# EasyEDA Pro project ProPrj_FOC Motor Driver _V02.epro, schematic Schematic1
Board Name: Board1; Create Date: 2026-07-21; Page Name: P1; Project Name: FOC Motor Driver; Schematic Name: Schematic1; Update Date: 2026-07-21; Company: EasyEDA.com; Page Size: A4; Version: V1.0
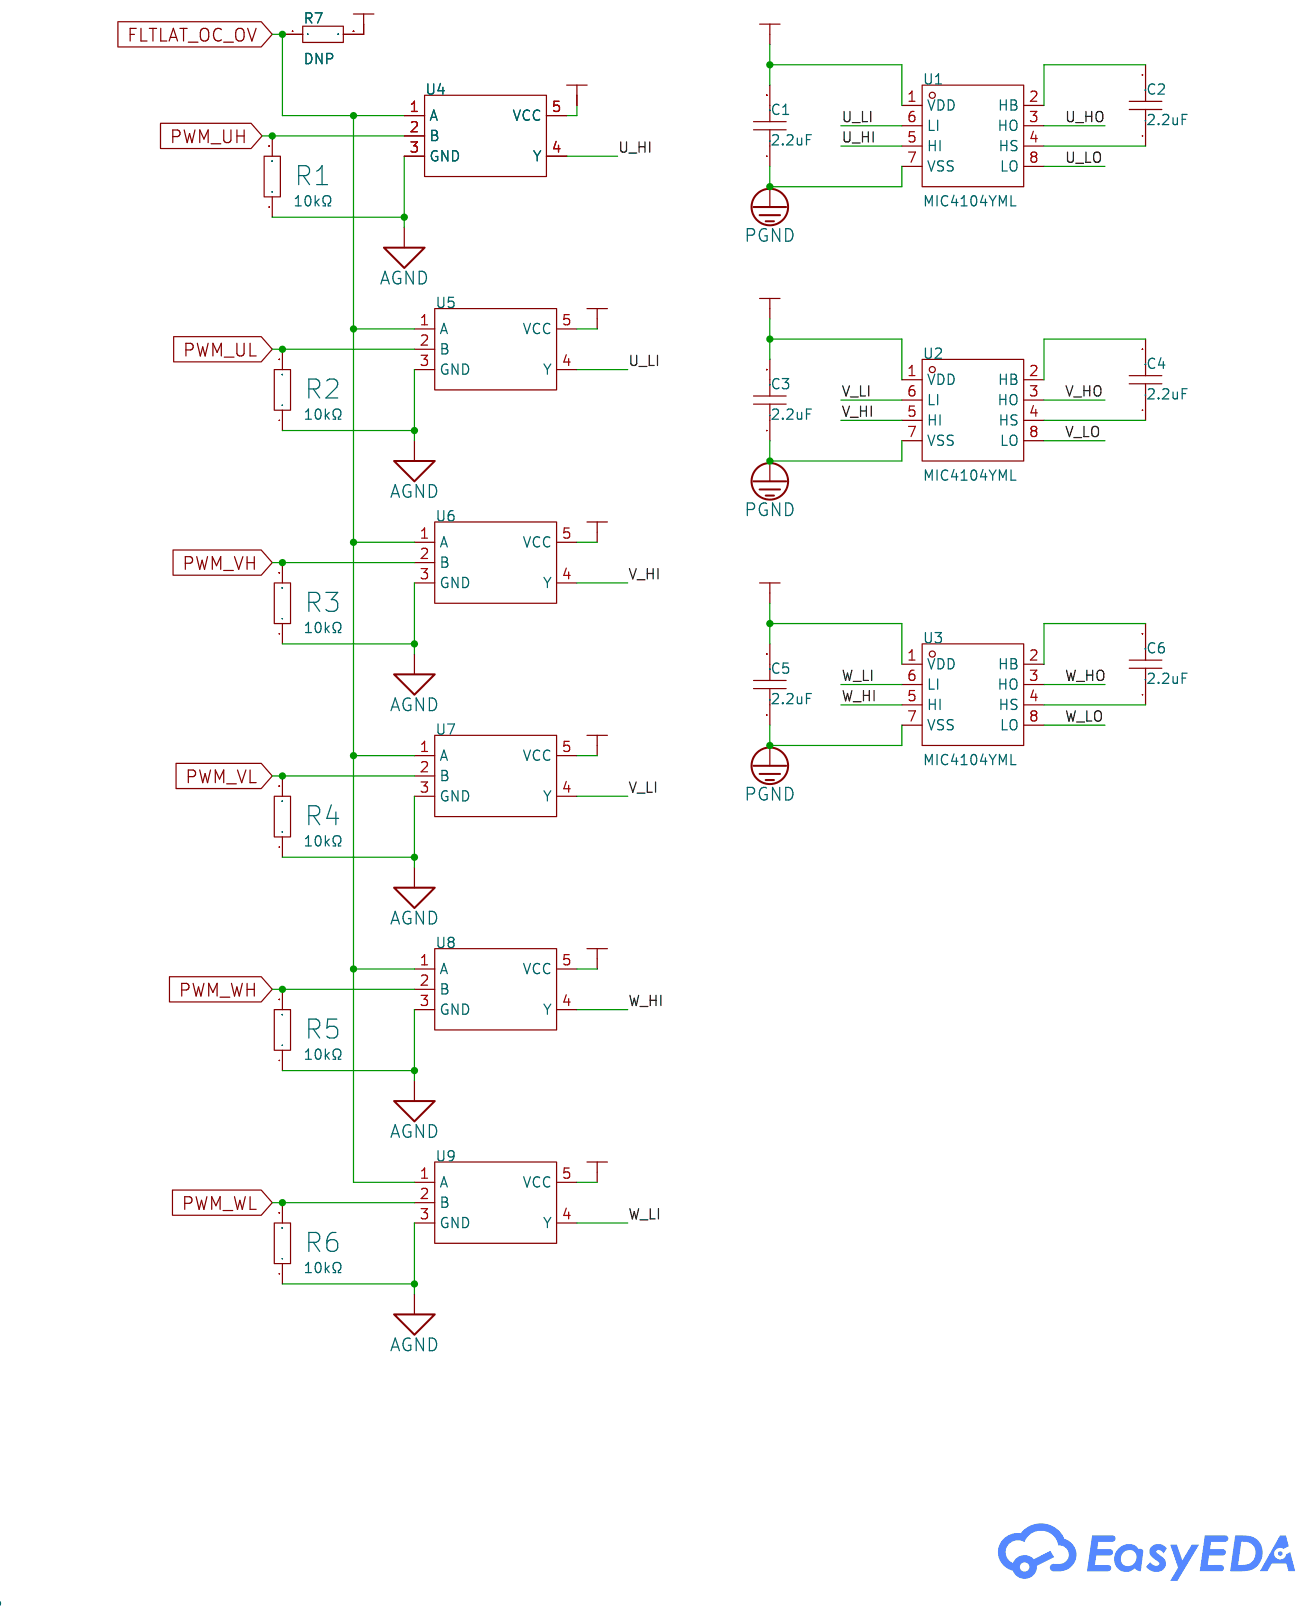
[diagram p0: schematic sheet]

## Parts
C1  2.2uF  [C0805]
C2  2.2uF  [C0805]
C3  2.2uF  [C0805]
C4  2.2uF  [C0805]
C5  2.2uF  [C0805]
C6  2.2uF  [C0805]
R1  10kΩ  [R0603]
R2  10kΩ  [R0603]
R3  10kΩ  [R0603]
R4  10kΩ  [R0603]
R5  10kΩ  [R0603]
R6  10kΩ  [R0603]
R7  0Ω  [R0603]
U1  MIC4104YML  [SOIC-8_L4.9-W3.9-P1.27-LS6.0-BL]
U2  MIC4104YML  [SOIC-8_L4.9-W3.9-P1.27-LS6.0-BL]
U3  MIC4104YML  [SOIC-8_L4.9-W3.9-P1.27-LS6.0-BL]
U4  SN74LVC1G08DCKR(UMW)  [SC-70-5_L2.0-W1.3-P0.65-LS2.1-BR]
U5  SN74LVC1G08DCKR(UMW)  [SC-70-5_L2.0-W1.3-P0.65-LS2.1-BR]
U6  SN74LVC1G08DCKR(UMW)  [SC-70-5_L2.0-W1.3-P0.65-LS2.1-BR]
U7  SN74LVC1G08DCKR(UMW)  [SC-70-5_L2.0-W1.3-P0.65-LS2.1-BR]
U8  SN74LVC1G08DCKR(UMW)  [SC-70-5_L2.0-W1.3-P0.65-LS2.1-BR]
U9  SN74LVC1G08DCKR(UMW)  [SC-70-5_L2.0-W1.3-P0.65-LS2.1-BR]

## Library data of the parts
C1-C6 = CL21A225KBQNNNE: Capacitance:2.2uF Tolerance:±10% Tolerance:±10% Voltage Rating:50V Temperature Coefficient:X5R; LCSC Part Name: 2.2uF ±10% 50V; Supplier Part: C377773; Manufacturer: SAMSUNG(三星); Supplier Footprint: 0805; Datasheet: https://item.szlcsc.com/datasheet/CL21A225KBQNNNE/350246.html; Supplier: LCSC; Tolerance: ±10%; Voltage Rating: 50V; Temperature Coefficient: X5R
R1-R6 = 0603WAF1002T5E: Type:Thick Film Resistor Resistance:10kΩ Tolerance:±1% Tolerance:±1% Power(Watts):100mW Voltage-Supply(Max):75V Temperature Coefficient:±100ppm/℃ Temperature Coefficient:±100ppm/℃ Operating Temperature:-55℃~+155℃ Operating Temperature:-55℃~+155℃; LCSC Part Name: 厚膜电阻 10kΩ ±1% 100mW; Supplier Part: C25804; Manufacturer: UNI-ROYAL(厚声); Supplier Footprint: 0603; JLCPCB Part Class: Basic Part; Datasheet: https://item.szlcsc.com/datasheet/0603WAF1002T5E/26547.html; Supplier: LCSC; Type: Thick Film Resistor; Tolerance: ±1%; Power(Watts): 100mW; Voltage-Supply(Max): 75V; Temperature Coefficient: ±100ppm/℃; Operating Temperature: -55℃~+155℃
R7 = 0603WAF0000T5E: Type:Thick Film Resistor Resistance:0Ω Tolerance:±1% Tolerance:±1% Power(Watts):100mW Voltage-Supply(Max):75V Temperature Coefficient:- Temperature Coefficient:- Operating Temperature:-55℃~+155℃ Operating Temperature:-55℃~+155℃; LCSC Part Name: 0Ω ±1% 100mW 厚膜电阻; Supplier Part: C21189; Manufacturer: UNI-ROYAL(厚声); Supplier Footprint: 0603; Datasheet: https://item.szlcsc.com/datasheet/0603WAF0000T5E/21903.html; Supplier: LCSC; Type: Thick Film Resistor; Tolerance: ±1%; Power(Watts): 100mW; Voltage-Supply(Max): 75V; Operating Temperature: -55℃~+155℃
U1-U3 = MIC4104YML: Driven Configuration:Half-Bridge Load Type:MOSFET Number of Drivers:2 Current - Output Low(IOL):3A Current - Output High(IOH):2A Voltage - Supply:9V~16V Voltage - Supply:9V~16V Rise Time:10ns Fall Time:6ns Propagation Delay tpLH:- Propagation Delay tpHL:-; Supplier Part: C3655660; Manufacturer: MICROCHIP(美国微芯); Supplier Footprint: SOIC-8; Datasheet: https://item.szlcsc.com/datasheet/MIC4104YML/4223457.html; Supplier: LCSC; Driven Configuration: Half-Bridge; Load Type: MOSFET; Number of Drivers: 2; Current - Output Low(IOL): 3A; Current - Output High(IOH): 2A; Voltage - Supply: 9V~16V; Rise Time: 10ns; Fall Time: 6ns; Features: Under Voltage Protection; Operating Temperature: -40℃~+125℃
U4-U9 = SN74LVC1G08DCKR(UMW): Logic Type:AND Gate Number of Channels:1 Voltage - Supply:1.65V~5.5V Voltage - Supply:1.65V~5.5V Quiescent Current:10uA Current - Output Low(IOL):32mA Current - Output High(IOH):32mA Input Logic Level - High:1.7V Input Logic Level - High:1.7V Input Logic; LCSC Part Name: 逻辑芯片; Supplier Part: C2983745; Manufacturer: UMW(友台半导体); Supplier Footprint: SC-70-5; JLCPCB Part Class: Extended Part; Datasheet: https://item.szlcsc.com/datasheet/SN74LVC1G08DCKR(UMW)/3422605.html; Supplier: LCSC; Logic Type: AND Gate; Number of Channels: 1; Voltage - Supply: 1.65V~5.5V; Quiescent Current: 10uA; Current - Output Low(IOL): 32mA; Current - Output High(IOH): 32mA; Input Logic Level - High: 1.7V; Input Logic Level - Low: 700mV; Output Logic Level - High: 1.9V；2.4V；2.3V；1.2V；3.8V; Output Logic Level - Low: 550mV；550mV；100mV；300mV；400mV；450mV; Series: 74LVC Series; Propagation Delay: 10ns@5V,15pF; Operating Temperature: -40℃~+105℃; Input Number: 2

## Nets
3.3V: R7.2 U4.5(VCC) U5.5(VCC) U6.5(VCC) U7.5(VCC) U8.5(VCC) U9.5(VCC)
12V: C1.2 C3.2 C5.2 U1.1(VDD) U2.1(VDD) U3.1(VDD)
AGND: R1.1 R2.1 R3.1 R4.1 R5.1 R6.1 U4.3(GND) U5.3(GND) U6.3(GND) U7.3(GND) U8.3(GND) U9.3(GND)
PGND: C1.1 C3.1 C5.1 U1.7(VSS) U2.7(VSS) U3.7(VSS)
FLTLAT_OC_OV: R7.1 U4.1(A) U5.1(A) U6.1(A) U7.1(A) U8.1(A) U9.1(A)
PWM_UH: R1.2 U4.2(B)
PWM_UL: R2.2 U5.2(B)
PWM_VH: R3.2 U6.2(B)
PWM_VL: R4.2 U7.2(B)
PWM_WH: R5.2 U8.2(B)
PWM_WL: R6.2 U9.2(B)
U_HI: U1.5(HI) U4.4(Y)
U_HO: U1.3(HO)
U_LI: U1.6(LI) U5.4(Y)
U_LO: U1.8(LO)
V_HI: U2.5(HI) U6.4(Y)
V_HO: U2.3(HO)
V_LI: U2.6(LI) U7.4(Y)
V_LO: U2.8(LO)
W_HI: U3.5(HI) U8.4(Y)
W_HO: U3.3(HO)
W_LI: U3.6(LI) U9.4(Y)
W_LO: U3.8(LO)
$1N524: C2.2 U1.2(HB)
$1N532: C2.1 U1.4(HS)
$1N703: C4.2 U2.2(HB)
$1N706: C4.1 U2.4(HS)
$1N875: C6.2 U3.2(HB)
$1N878: C6.1 U3.4(HS)
